# Altium schematic sheet TP_IHM_CONNECTOR.SchDoc
size A4
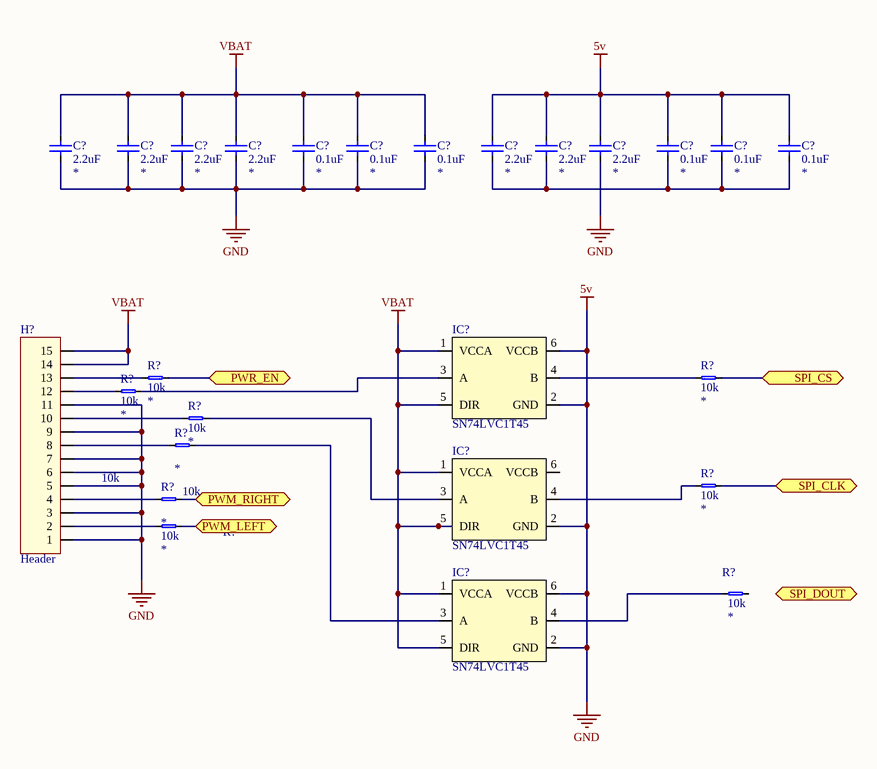
[diagram p0: TP_IHM_CONNECTOR.SchDoc]

## Parts
(Parts that share a designator on the sheet are numbered #1, #2 ... from top to bottom, then left to right.)
C?#1  value 2.2uF  [0603_CAP_LD]  (hidden comment: CerCap)
C?#2  value 2.2uF  [0603_CAP_LD]  (hidden comment: CerCap)
C?#3  value 2.2uF  [0603_CAP_LD]  (hidden comment: CerCap)
C?#4  value 2.2uF  [0603_CAP_LD]  (hidden comment: CerCap)
C?#5  value 0.1uF  [0603_CAP_LD]  (hidden comment: CerCap)
C?#6  value 0.1uF  [0603_CAP_LD]  (hidden comment: CerCap)
C?#7  value 0.1uF  [0603_CAP_LD]  (hidden comment: CerCap)
C?#8  value 2.2uF  [0603_CAP_LD]  (hidden comment: CerCap)
C?#9  value 2.2uF  [0603_CAP_LD]  (hidden comment: CerCap)
C?#10  value 2.2uF  [0603_CAP_LD]  (hidden comment: CerCap)
C?#11  value 0.1uF  [0603_CAP_LD]  (hidden comment: CerCap)
C?#12  value 0.1uF  [0603_CAP_LD]  (hidden comment: CerCap)
C?#13  value 0.1uF  [0603_CAP_LD]  (hidden comment: CerCap)
H?  Header  [653115131822]
IC?#1  SN74LVC1T45  [MO-203AB_LD]
IC?#2  SN74LVC1T45  [MO-203AB_LD]
IC?#3  SN74LVC1T45  [MO-203AB_LD]
R?#1  value 10k  [0603_RES_LD]  (hidden comment: Resistor)
R?#2  value 10k  [0603_RES_LD]  (hidden comment: Resistor)
R?#3  value 10k  [0603_RES_LD]  (hidden comment: Resistor)
R?#4  value 10k  [0603_RES_LD]  (hidden comment: Resistor)
R?#5  value 10k  [0603_RES_LD]  (hidden comment: Resistor)
R?#6  value 10k  [0603_RES_LD]  (hidden comment: Resistor)
R?#7  value 10k  [0603_RES_LD]  (hidden comment: Resistor)
R?#8  value 10k  [0603_RES_LD]  (hidden comment: Resistor)
R?#9  value 10k  [0603_RES_LD]  (hidden comment: Resistor)

## Ports
PWM_LEFT, PWM_RIGHT, PWR_EN, SPI_CLK, SPI_CS, SPI_DOUT

## Nets
5v: C?#1.1 C?#2.1 C?#3.1 C?#4.1 C?#5.1 C?#6.1 C?#7.1 C?#8.2 C?#9.2 C?#10.1 C?#10.2 C?#11.2 C?#12.2 C?#13.2 H?.1 H?.3 H?.5 H?.6 H?.7 H?.9 H?.11 IC?#1.2(GND) IC?#1.6(VCCB) IC?#2.2(GND) IC?#3.2(GND) IC?#3.6(VCCB)  [also labelled GND]
VBAT: C?#1.2 C?#2.2 C?#3.2 C?#4.2 C?#5.2 C?#6.2 C?#7.2 H?.14 H?.15 IC?#1.1(VCCA) IC?#1.5(DIR) IC?#2.1(VCCA) IC?#2.5(DIR) IC?#3.1(VCCA) IC?#3.5(DIR)
PWM_LEFT: R?#8.2 ; port PWM_LEFT
PWM_RIGHT: R?#7.2 ; port PWM_RIGHT
PWR_EN: R?#1.2 ; port PWR_EN
SPI_CLK: R?#6.2 ; port SPI_CLK
SPI_CS: R?#2.2 ; port SPI_CS
NetC?#8_1: C?#8.1 C?#9.1 C?#11.1 C?#12.1 C?#13.1
NetH?_2: H?.2 R?#8.1
NetH?_4: H?.4 R?#7.1
NetH?_8: H?.8 R?#5.1
NetH?_10: H?.10 R?#4.1
NetH?_12: H?.12 R?#3.1
NetH?_13: H?.13 R?#1.1
NetIC?#1_3: IC?#1.3(A) R?#3.2
NetIC?#1_4: IC?#1.4(B) R?#2.1
NetIC?#2_3: IC?#2.3(A) R?#4.2
NetIC?#2_4: IC?#2.4(B) R?#6.1
NetIC?#3_3: IC?#3.3(A) R?#5.2
NetIC?#3_4: IC?#3.4(B) R?#9.1

Not connected (* = marked no-connect by the designer): IC?#2 6(VCCB); R?#9 2

## Library data of the parts
C?#1-C?#13 = CerCap: Ceramic Capacitor; Type: *; Voltage/Power: *; Package: *
H? = HEADER_15x1: Header 15x1
IC?#1-IC?#3 = SN74LVC1T45: Single Bit Dual Supply Buffer
R?#1-R?#9 = Resistor: Precision: *; Package: *